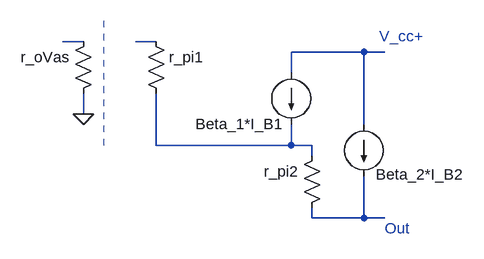
[diagram p0: schematic npn_darlington.asc]
npn_darlington.asc, the LTspice schematic file:
Version 4
SHEET 1 880 680
WIRE -80 112 -112 112
WIRE 32 112 0 112
WIRE 352 128 240 128
WIRE 384 128 352 128
WIRE 240 160 240 128
WIRE -80 224 -80 192
WIRE 352 240 352 128
WIRE 32 272 32 192
WIRE 240 272 240 240
WIRE 240 272 32 272
WIRE 272 272 240 272
WIRE 272 288 272 272
WIRE 272 384 272 368
WIRE 352 384 352 320
WIRE 352 384 272 384
WIRE 384 384 352 384
FLAG -80 224 0
SYMBOL res 16 96 R0
SYMATTR InstName r_pi1
SYMATTR Value ""
SYMBOL res -64 96 M0
WINDOW 3 36 68 Left 2
SYMATTR Value ""
SYMATTR InstName r_oVas
SYMBOL current 240 160 M0
WINDOW 0 12 79 Left 2
SYMATTR InstName Beta_1*I_B1
SYMATTR Value ""
SYMBOL current 352 240 R0
WINDOW 0 18 77 Left 2
SYMATTR InstName Beta_2*I_B2
SYMATTR Value ""
SYMBOL res 288 272 M0
SYMATTR InstName r_pi2
SYMATTR Value ""
TEXT 376 104 Left 2 ;V_cc+
TEXT 384 400 Left 2 ;Out
LINE Normal -48 272 -48 80 2

The netlist it stands for:
* npn_darlington.asc
r_pi1 N002 N004
r_oVas N001 0
I§Beta_1*I_B1 N003 N004
I§Beta_2*I_B2 N003 N005
r_pi2 N004 N005
* V_cc+
* Out
.backanno
.end